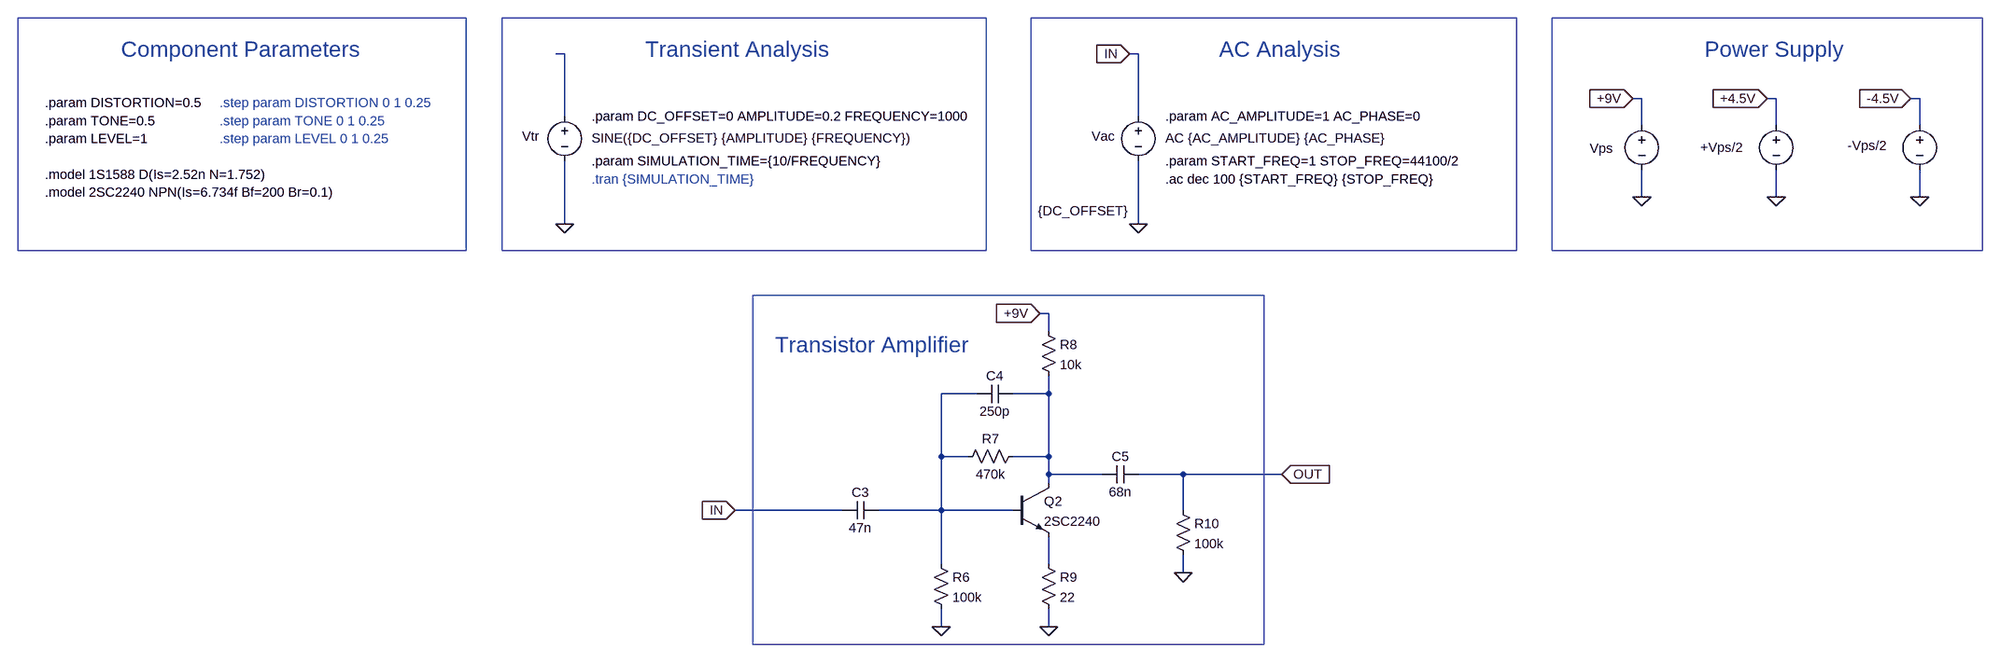
[diagram p0: schematic 2. Transistor Amplifier (Abridged).asc]
2. Transistor Amplifier (Abridged).asc, the LTspice schematic file:
Version 4
SHEET 1 6076 2100
WIRE 16 16 0 16
WIRE 1040 16 1024 16
WIRE 1952 96 1936 96
WIRE 2192 96 2176 96
WIRE 2448 96 2432 96
WIRE 16 128 16 16
WIRE 1040 128 1040 16
WIRE 1952 144 1952 96
WIRE 2192 144 2192 96
WIRE 2448 144 2448 96
WIRE 1952 272 1952 224
WIRE 2192 272 2192 224
WIRE 2448 272 2448 224
WIRE 16 320 16 208
WIRE 1040 320 1040 208
WIRE 880 480 864 480
WIRE 880 512 880 480
WIRE 752 624 688 624
WIRE 880 624 880 592
WIRE 880 624 816 624
WIRE 688 736 688 624
WIRE 736 736 688 736
WIRE 880 736 880 624
WIRE 880 736 816 736
WIRE 880 768 880 736
WIRE 976 768 880 768
WIRE 1120 768 1040 768
WIRE 1296 768 1120 768
WIRE 880 784 880 768
WIRE 512 832 320 832
WIRE 688 832 688 736
WIRE 688 832 576 832
WIRE 816 832 688 832
WIRE 1120 832 1120 768
WIRE 688 928 688 832
WIRE 880 928 880 880
WIRE 1120 944 1120 912
WIRE 688 1040 688 1008
WIRE 880 1040 880 1008
FLAG 1040 320 0
FLAG 688 1040 0
FLAG 880 1040 0
FLAG 864 480 +9V
IOPIN 864 480 In
FLAG 16 320 0
FLAG 1296 768 OUT
IOPIN 1296 768 In
FLAG 1024 16 IN
IOPIN 1024 16 In
FLAG 320 832 IN
IOPIN 320 832 In
FLAG 1120 944 0
FLAG 1952 272 0
FLAG 1936 96 +9V
IOPIN 1936 96 In
FLAG 2192 272 0
FLAG 2176 96 +4.5V
IOPIN 2176 96 In
FLAG 2448 272 0
FLAG 2432 96 -4.5V
IOPIN 2432 96 In
SYMBOL voltage 1040 112 R0
WINDOW 3 -179 185 Left 2
WINDOW 123 48 55 Left 2
WINDOW 39 0 0 Left 0
WINDOW 0 -83 52 Left 2
SYMATTR Value {DC_OFFSET}
SYMATTR Value2 AC {AC_AMPLITUDE} {AC_PHASE}
SYMATTR InstName Vac
SYMBOL cap 576 816 R90
WINDOW 0 0 32 VBottom 2
WINDOW 3 32 32 VTop 2
SYMATTR InstName C3
SYMATTR Value 47n
SYMBOL cap 816 608 R90
WINDOW 0 0 32 VBottom 2
WINDOW 3 32 32 VTop 2
SYMATTR InstName C4
SYMATTR Value 250p
SYMBOL npn 816 784 R0
SYMATTR InstName Q2
SYMATTR Value 2SC2240
SYMBOL res 672 912 R0
SYMATTR InstName R6
SYMATTR Value 100k
SYMBOL res 832 720 R90
WINDOW 0 0 56 VBottom 2
WINDOW 3 32 56 VTop 2
SYMATTR InstName R7
SYMATTR Value 470k
SYMBOL res 864 496 R0
SYMATTR InstName R8
SYMATTR Value 10k
SYMBOL res 864 912 R0
SYMATTR InstName R9
SYMATTR Value 22
SYMBOL cap 1040 752 R90
WINDOW 0 0 32 VBottom 2
WINDOW 3 32 32 VTop 2
SYMATTR InstName C5
SYMATTR Value 68n
SYMBOL res 1104 816 R0
SYMATTR InstName R10
SYMATTR Value 100k
SYMBOL voltage 16 112 R0
WINDOW 3 48 55 Left 2
WINDOW 123 29 129 Left 2
WINDOW 39 0 0 Left 0
WINDOW 0 -76 52 Left 2
SYMATTR Value SINE({DC_OFFSET} {AMPLITUDE} {FREQUENCY})
SYMATTR InstName Vtr
SYMBOL voltage 1952 128 R0
WINDOW 0 -93 57 Left 2
WINDOW 3 24 96 Invisible 2
WINDOW 123 0 0 Left 0
WINDOW 39 0 0 Left 0
SYMATTR InstName Vps
SYMATTR Value 9
SYMBOL voltage 2192 128 R0
WINDOW 0 -135 56 Left 2
WINDOW 3 24 96 Invisible 2
WINDOW 123 0 0 Left 0
WINDOW 39 0 0 Left 0
SYMATTR InstName +Vps/2
SYMATTR Value 4.5
SYMBOL voltage 2448 128 R0
WINDOW 0 -129 52 Left 2
WINDOW 3 24 96 Invisible 2
WINDOW 123 0 0 Left 0
WINDOW 39 0 0 Left 0
SYMATTR InstName -Vps/2
SYMATTR Value -4.5
TEXT -776 8 Left 4 ;Component Parameters
TEXT 1088 240 Left 2 !.ac dec 100 {START_FREQ} {STOP_FREQ}
TEXT 392 536 Left 4 ;Transistor Amplifier
TEXT 64 240 Left 2 ;.tran {SIMULATION_TIME}
TEXT -600 104 Left 2 ;.step param DISTORTION 0 1 0.25
TEXT -600 136 Left 2 ;.step param TONE 0 1 0.25
TEXT 64 208 Left 2 !.param SIMULATION_TIME={10/FREQUENCY}
TEXT 160 8 Left 4 ;Transient Analysis
TEXT 64 128 Left 2 !.param DC_OFFSET=0 AMPLITUDE=0.2 FREQUENCY=1000
TEXT 1184 8 Left 4 ;AC Analysis
TEXT 1088 128 Left 2 !.param AC_AMPLITUDE=1 AC_PHASE=0
TEXT 1088 208 Left 2 !.param START_FREQ=1 STOP_FREQ=44100/2
TEXT -912 264 Left 2 !.model 2SC2240 NPN(Is=6.734f Bf=200 Br=0.1)
TEXT -912 232 Left 2 !.model 1S1588 D(Is=2.52n N=1.752)
TEXT -912 136 Left 2 !.param TONE=0.5
TEXT -912 168 Left 2 !.param LEVEL=1
TEXT -600 168 Left 2 ;.step param LEVEL 0 1 0.25
TEXT -912 104 Left 2 !.param DISTORTION=0.5
TEXT 2064 8 Left 4 ;Power Supply
RECTANGLE Normal 1264 1072 352 448
RECTANGLE Normal 768 368 -96 -48
RECTANGLE Normal 1728 368 848 -48
RECTANGLE Normal -160 368 -960 -48
RECTANGLE Normal 2560 368 1792 -48

The netlist it stands for:
* 2. Transistor Amplifier (Abridged).asc
Vac IN 0 {DC_OFFSET} AC {AC_AMPLITUDE} {AC_PHASE}
C3 N002 IN 47n
C4 N003 N002 250p
Q2 N003 N002 N004 0 2SC2240
R6 N002 0 100k
R7 N003 N002 470k
R8 +9V N003 10k
R9 N004 0 22
C5 OUT N003 68n
R10 OUT 0 100k
Vtr N001 0 SINE({DC_OFFSET} {AMPLITUDE} {FREQUENCY})
Vps +9V 0 9
V§+Vps/2 +4.5V 0 4.5
V§-Vps/2 -4.5V 0 -4.5
.model NPN NPN
.model PNP PNP
.lib standard.bjt
* Component Parameters
.ac dec 100 {START_FREQ} {STOP_FREQ}
* Transistor Amplifier
* .tran {SIMULATION_TIME}
* .step param DISTORTION 0 1 0.25
* .step param TONE 0 1 0.25
.param SIMULATION_TIME={10/FREQUENCY}
* Transient Analysis
.param DC_OFFSET=0 AMPLITUDE=0.2 FREQUENCY=1000
* AC Analysis
.param AC_AMPLITUDE=1 AC_PHASE=0
.param START_FREQ=1 STOP_FREQ=44100/2
.model 2SC2240 NPN(Is=6.734f Bf=200 Br=0.1)
.model 1S1588 D(Is=2.52n N=1.752)
.param TONE=0.5
.param LEVEL=1
* .step param LEVEL 0 1 0.25
.param DISTORTION=0.5
* Power Supply
.backanno
.end